# Altium schematic sheet USB.SchDoc: USB - UART Schnittstelle
size A4; Author: Gerald Ebmer; DrawnBy: Gerald Ebmer; Engineer: Gerald Ebmer; Revision: 1.1; SheetNumber: 2; SheetTotal: 6; PageSetup: Record=PageOptions|CenterHorizontal=True|CenterVertical=True|PrintScale=1.00|XCorrection=1.00|YCorrection=1.00|PrintKind=0|BorderSize=5000000|LeftOffset=0|BottomOffset=0|Orientation=2|PaperLength=1000|PaperWidth=1000|Scale=100|PaperSource=7|PrintQuality=-3|MediaType=1|DitherType=10|PrintScaleMode=1|PaperKind=A4|PaperIndex=9
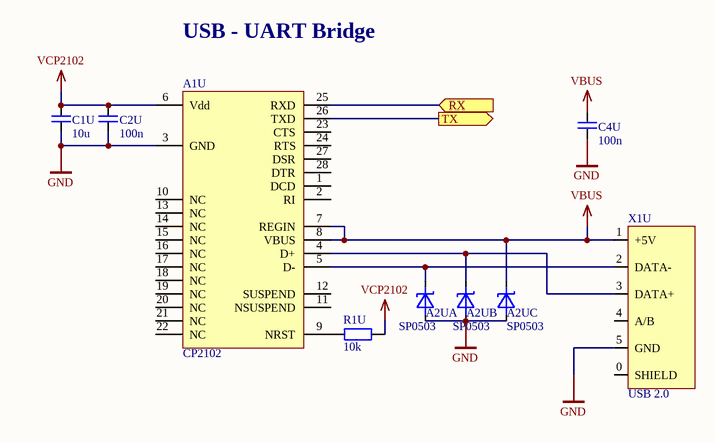
[diagram p0: USB.SchDoc]

## Parts
A1U  CP2102  [QFN28]
A2U  SP0503  [SOT143-4]  (parts A,B,C of 3)
C1U  10u  [0805]
C2U  100n  [0805]
C4U  100n  [0805]
R1U  10k  [0805]
X1U  USB 2.0  [USB Mini AB]

## Ports
RX (in), TX (out)

## Nets
GND: A1U.3(GND) A2U.1(Annode) C1U.1 C2U.1 C4U.1 X1U.5(GND)
VBUS: A1U.7(REGIN) A1U.8(VBUS) A2U.4(K3) C4U.2 X1U.1(+5V)
VCP2102: A1U.6(Vdd) C1U.2 C2U.2 R1U.2
RX: A1U.25(RXD) ; port RX
TX: A1U.26(TXD) ; port TX
NetA1U_4: A1U.4(D+) A2U.3(K3) X1U.3(DATA+)
NetA1U_5: A1U.5(D-) A2U.2(K1) X1U.2(DATA-)
NetA1U_9: A1U.9(NRST) R1U.1

Not connected (* = marked no-connect by the designer): A1U 1(DCD) 2(RI) 10(NC) 11(NSUSPEND) 12(SUSPEND) 13(NC) 14(NC) 15(NC) 16(NC) 17(NC) 18(NC) 19(NC) 20(NC) 21(NC) 22(NC) 23(CTS) 24(RTS) 27(DSR) 28(DTR); X1U 0(SHIELD) 4(A/B)

## Notes on the sheet
- USB - UART Bridge
- Title
- Size:
- Date:
- A4
- Number:
- Time:
- Revision:
- Sheet
- of
- File:

## Library data of the parts
A1U = CP2102: USB-UART Bridge; Bauform: QFN-28; Bestell-Nr.: 526-8841; Bezeichnung: CP2102-GM; Hersteller: Silicon Labs; Lieferant: RS Components
A2U = SP0503: ESD Suppressors; Bauform: SMD; Bestell-Nr.: 793-1967; Bezeichnung: SP0503BAHTG; Hersteller: Littelfuse; Lieferant: RS Components
C1U = Kondensator: Bezeichnung: C1210C106K3RACTU; Hersteller: Kemet; Lieferant: Farnell; Bestell-Nr.: 1358512; Bauform: 0805
C2U C4U = Kondensator: Bezeichnung: 08055C104KAT2A; Hersteller: AVX; Lieferant: RS Components; Bestell-Nr.: 464-6688; Bauform: 0805
R1U = Widerstand: Bezeichnung: MCWR08X1002FTL; Lieferant: Farnell; Bestell-Nr.: 2447553; Hersteller: MULTICOMP; Bauform: 0805
X1U = USB 2.0: Hersteller: TE Connectivity; Lieferant: Farnell; Bezeichnung: 1734328-1; Bestell-Nr.: 2112375; Bauform: USB-Mini AB